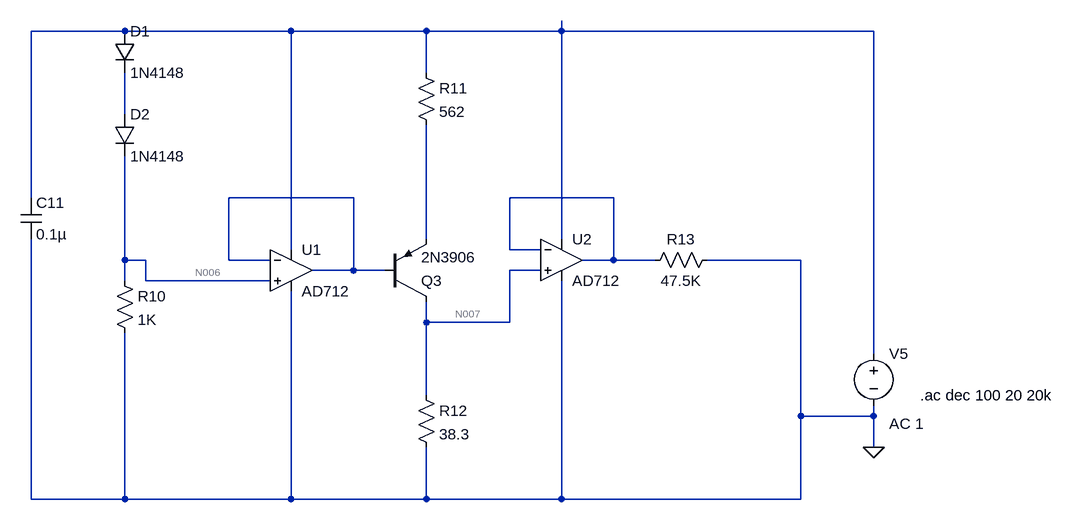
[diagram p0: schematic CA3240E.asc]
CA3240E.asc, the LTspice schematic file:
Version 4
SHEET 1 1972 852
WIRE -320 -1088 -464 -1088
WIRE -64 -1088 -320 -1088
WIRE 144 -1088 -64 -1088
WIRE 352 -1088 352 -1104
WIRE 352 -1088 144 -1088
WIRE 832 -1088 352 -1088
WIRE 144 -1024 144 -1088
WIRE -320 -960 -320 -1024
WIRE -464 -832 -464 -1088
WIRE 32 -832 -160 -832
WIRE 432 -832 272 -832
WIRE 144 -768 144 -944
WIRE 352 -768 352 -1088
WIRE -64 -752 -64 -1088
WIRE 272 -752 272 -832
WIRE 320 -752 272 -752
WIRE -320 -736 -320 -896
WIRE -288 -736 -320 -736
WIRE -160 -736 -160 -832
WIRE -96 -736 -160 -736
WIRE 432 -736 432 -832
WIRE 432 -736 384 -736
WIRE 496 -736 432 -736
WIRE 720 -736 576 -736
WIRE 32 -720 32 -832
WIRE 32 -720 -32 -720
WIRE 80 -720 32 -720
WIRE 320 -720 272 -720
WIRE -320 -704 -320 -736
WIRE -288 -704 -288 -736
WIRE -96 -704 -288 -704
WIRE 144 -640 144 -672
WIRE 272 -640 272 -720
WIRE 272 -640 144 -640
WIRE 832 -592 832 -1088
WIRE 144 -528 144 -640
WIRE 720 -496 720 -736
WIRE 832 -496 832 -512
WIRE 832 -496 720 -496
WIRE 832 -448 832 -496
WIRE -464 -368 -464 -768
WIRE -320 -368 -320 -624
WIRE -320 -368 -464 -368
WIRE -64 -368 -64 -688
WIRE -64 -368 -320 -368
WIRE 144 -368 144 -448
WIRE 144 -368 -64 -368
WIRE 352 -368 352 -704
WIRE 352 -368 144 -368
WIRE 720 -368 720 -496
WIRE 720 -368 352 -368
FLAG 832 -448 0
SYMBOL OpAmps\\AD712 -64 -784 R0
SYMATTR InstName U1
SYMBOL OpAmps\\AD712 352 -800 R0
SYMATTR InstName U2
SYMBOL pnp 80 -672 M180
SYMATTR InstName Q3
SYMATTR Value 2N3906
SYMBOL cap -480 -832 R0
SYMATTR InstName C11
SYMATTR Value 0.1µ
SYMATTR SpiceLine V=25 Irms=835m Rser=0.0936732 Lser=0 mfg="KEMET" pn="C1812C104K3RAC" type="X7R"
SYMBOL diode -336 -1088 R0
SYMATTR InstName D1
SYMATTR Value 1N4148
SYMBOL diode -336 -960 R0
SYMATTR InstName D2
SYMATTR Value 1N4148
SYMBOL res -336 -720 R0
SYMATTR InstName R10
SYMATTR Value 1K
SYMATTR SpiceLine tol=1 pwr=0.1
SYMBOL res 128 -1040 R0
SYMATTR InstName R11
SYMATTR Value 562
SYMATTR SpiceLine tol=1 pwr=0.1
SYMBOL res 128 -544 R0
SYMATTR InstName R12
SYMATTR Value 38.3
SYMATTR SpiceLine tol=1 pwr=0.1
SYMBOL res 592 -752 R90
WINDOW 0 0 56 VBottom 2
WINDOW 3 32 56 VTop 2
SYMATTR InstName R13
SYMATTR Value 47.5K
SYMATTR SpiceLine tol=1 pwr=0.1
SYMBOL voltage 832 -608 R0
WINDOW 123 24 124 Left 2
WINDOW 39 0 0 Left 2
SYMATTR Value2 AC 1
SYMATTR InstName V5
SYMATTR Value ""
TEXT 904 -528 Left 2 !.ac dec 100 20 20k

The netlist it stands for:
* CA3240E.asc
XU1 N006 N003 N001 0 N003 AD712  ; pins In+ In- V+ V- OUT
XU2 N007 N004 N001 0 N004 AD712  ; pins In+ In- V+ V- OUT
Q3 N007 N003 N005 0 2N3906
C11 N001 0 0.1µ V=25 Irms=835m Rser=0.0936732 Lser=0 mfg="KEMET" pn="C1812C104K3RAC" type="X7R"
D1 N001 N002 1N4148
D2 N002 N006 1N4148
R10 N006 0 1K tol=1 pwr=0.1
R11 N001 N005 562 tol=1 pwr=0.1
R12 N007 0 38.3 tol=1 pwr=0.1
R13 0 N004 47.5K tol=1 pwr=0.1
V5 N001 0 AC 1
.model D D
.lib standard.dio
.model NPN NPN
.model PNP PNP
.lib standard.bjt
.ac dec 100 20 20k
.backanno
.end

* Results of the author's LTspice run, read from the files saved beside the schematic
* Operating Point, zero values left out:
*   I(V5) = 240 µA
*   Ix(u1:3) = -120 µA
*   Ix(u1:4) = 120 µA
*   Ix(u2:3) = -120 µA
*   Ix(u2:4) = 120 µA
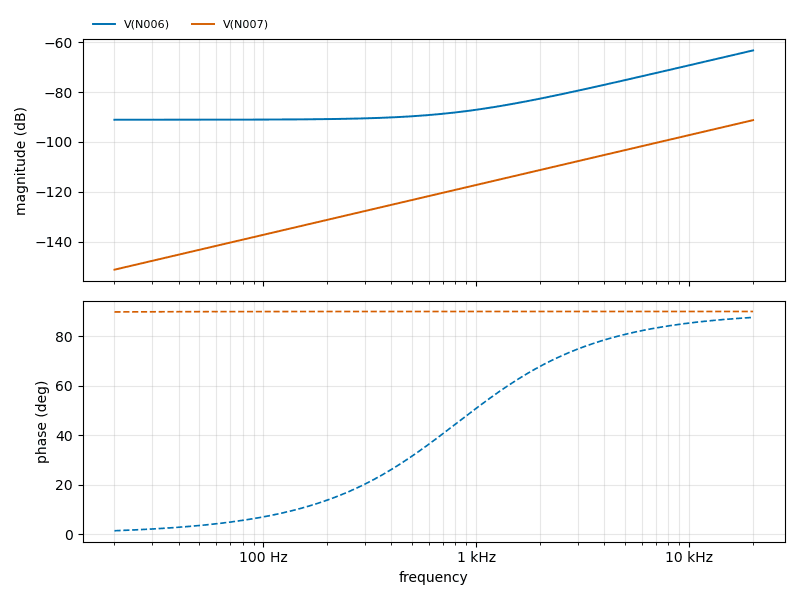
[diagram p1: AC Analysis of CA3240E.asc, plotted from the saved traces]
* AC Analysis, 1 run:
*   V(N006): -91.11 dB at 20 Hz, -63.30 dB at 20 kHz, peak -63.30 dB at 20 kHz, 3 dB below the peak at 14.13 kHz
*   V(N007): -151.28 dB at 20 Hz, -91.28 dB at 20 kHz, peak -91.28 dB at 20 kHz, 3 dB below the peak at 14.14 kHz